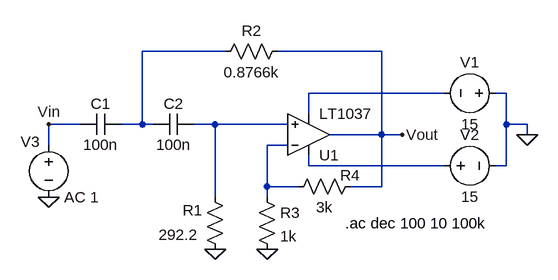
[diagram p0: schematic scheme3.asc]
scheme3.asc, the LTspice schematic file:
Version 4.1
SHEET 1 880 680
WIRE 32 32 -96 32
WIRE 272 32 112 32
WIRE 368 96 160 96
WIRE 464 96 448 96
WIRE 160 128 160 96
WIRE -192 144 -240 144
WIRE -96 144 -96 32
WIRE -96 144 -128 144
WIRE -80 144 -96 144
WIRE 16 144 -16 144
WIRE 128 144 16 144
WIRE 464 144 464 96
WIRE 496 144 464 144
WIRE 272 160 272 32
WIRE 272 160 192 160
WIRE 304 160 272 160
WIRE 496 160 496 144
WIRE -240 176 -240 144
WIRE 128 176 96 176
WIRE 160 208 160 192
WIRE 368 208 160 208
WIRE 464 208 464 144
WIRE 464 208 448 208
WIRE 96 240 96 176
WIRE 144 240 96 240
WIRE 272 240 272 160
WIRE 272 240 224 240
WIRE 16 256 16 144
WIRE 96 256 96 240
FLAG 496 160 0
FLAG -240 256 0
FLAG 16 336 0
FLAG 96 336 0
FLAG -240 144 Vin
FLAG 304 160 Vout
SYMBOL OpAmps\\LT1037 160 224 M180
SYMATTR InstName U1
SYMBOL voltage 464 96 R90
WINDOW 0 -32 56 VBottom 2
WINDOW 3 32 56 VTop 2
SYMATTR InstName V1
SYMATTR Value 15
SYMBOL voltage 352 208 R270
WINDOW 0 32 56 VTop 2
WINDOW 3 -32 56 VBottom 2
SYMATTR InstName V2
SYMATTR Value 15
SYMBOL res 0 240 R0
WINDOW 0 -34 36 Left 2
WINDOW 3 -71 74 Left 2
SYMATTR InstName R1
SYMATTR Value 292.2
SYMBOL res 128 16 R90
WINDOW 0 0 56 VBottom 2
WINDOW 3 32 56 VTop 2
SYMATTR InstName R2
SYMATTR Value 0.8766k
SYMBOL res 80 240 R0
SYMATTR InstName R3
SYMATTR Value 1k
SYMBOL res 240 224 R90
WINDOW 0 14 16 VBottom 2
WINDOW 3 32 56 VTop 2
SYMATTR InstName R4
SYMATTR Value 3k
SYMBOL cap -16 128 R90
WINDOW 0 0 32 VBottom 2
WINDOW 3 32 32 VTop 2
SYMATTR InstName C2
SYMATTR Value 100n
SYMBOL cap -128 128 R90
WINDOW 0 0 32 VBottom 2
WINDOW 3 32 32 VTop 2
SYMATTR InstName C1
SYMATTR Value 100n
SYMBOL voltage -240 160 R0
WINDOW 0 -43 11 Left 2
SYMATTR InstName V3
SYMATTR Value AC 1
TEXT 216 296 Left 2 !.ac dec 100 10 100k

The netlist it stands for:
* scheme3.asc
X§U1 N003 N004 N005 N002 Vout LT1037  ; pins In+ In- V+ V- OUT
V1 0 N002 15
V2 N005 0 15
R1 N003 0 292.2
R2 Vout N001 0.8766k
R3 N004 0 1k
R4 Vout N004 3k
C2 N003 N001 100n
C1 N001 Vin 100n
V3 Vin 0 AC 1
.ac dec 100 10 100k
.backanno
.end